# Altium project QuadSerial.PrjPcb
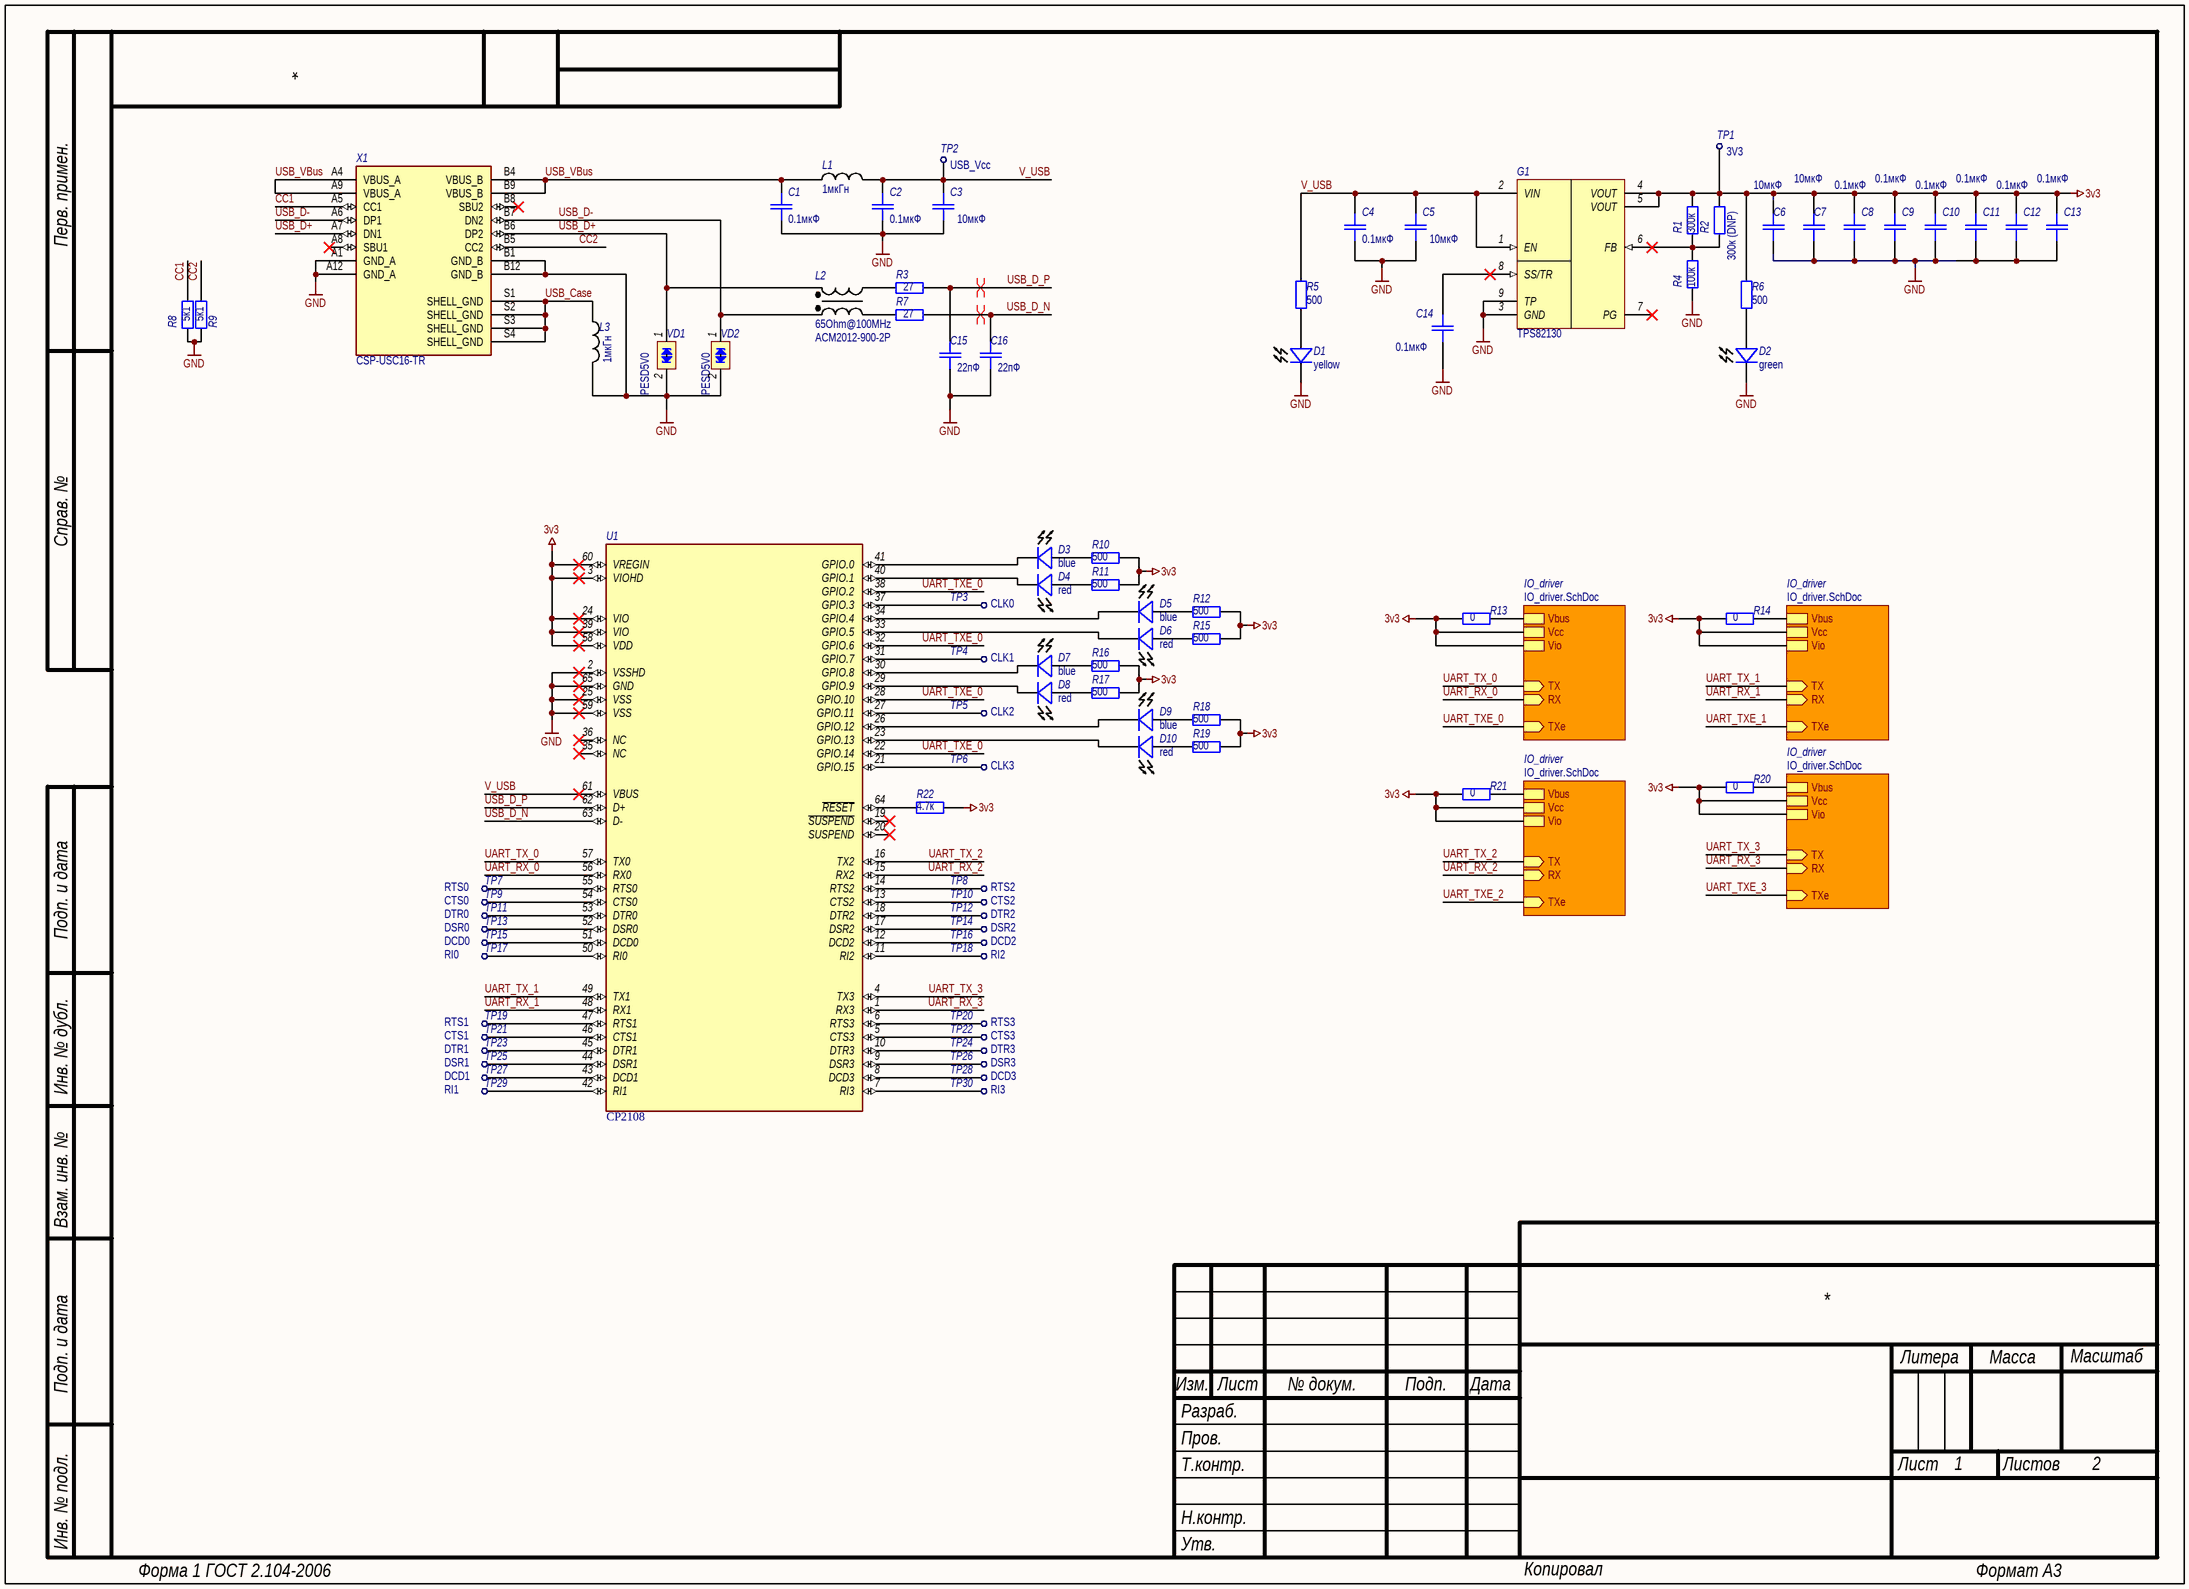
[diagram p0: main.SchDoc]
2 sheets, 182 parts. Net scope: hierarchical (ports join the sheet entries above them; power ports are global).
Board file: QuadSerial.PcbDoc
Sheets:
  main.SchDoc
    IO_driver = IO_driver.SchDoc
    IO_driver = IO_driver.SchDoc
    IO_driver = IO_driver.SchDoc
    IO_driver = IO_driver.SchDoc

## Sheet main.SchDoc
size 410 x 297 mm; SheetNumber: 1; SheetTotal: 2

### Parts
(Parts that share a designator on the sheet are numbered #1, #2 ... from top to bottom, then left to right.)
C1  0.1мкФ  [SMD_C0603]
C2  0.1мкФ  [SMD_C0603]
C3  10мкФ  [SMD_C0805]
C4  0.1мкФ  [SMD_C0603]
C5  10мкФ  [SMD_C0805]
C6  10мкФ  [SMD_C0805]
C7  10мкФ  [SMD_C0805]
C8  0.1мкФ  [SMD_C0603]
C9  0.1мкФ  [SMD_C0603]
C10  0.1мкФ  [SMD_C0603]
C11  0.1мкФ  [SMD_C0603]
C12  0.1мкФ  [SMD_C0603]
C13  0.1мкФ  [SMD_C0603]
C14  0.1мкФ  [SMD_C0603]
C15  22пФ  [SMD_C0603]
C16  22пФ  [SMD_C0603]
D1  value yellow  [LED_0603]  (hidden comment: LED)
D2  value green  [LED_0603]  (hidden comment: LED)
D3  value blue  [LED_0603]  (hidden comment: LED)
D4  value red  [LED_0603]  (hidden comment: LED)
D5  value blue  [LED_0603]  (hidden comment: LED)
D6  value red  [LED_0603]  (hidden comment: LED)
D7  value blue  [LED_0603]  (hidden comment: LED)
D8  value red  [LED_0603]  (hidden comment: LED)
D9  value blue  [LED_0603]  (hidden comment: LED)
D10  value red  [LED_0603]  (hidden comment: LED)
G1  TPS82130  [uSiL-8]
L1  1мкГн  [SMD_0805]
L2  65Ohm@100MHz  Наименование: ACM2012-900-2P  [ACM2012]
L3  1мкГн  [SMD_0805]
R1#1  300к  [SMD_0603]
R2#1  300к (DNP)  [SMD_0603]
R3  27  [SMD_0603]
R4  100к  [SMD_0603]
R5  500  [SMD_0603]
R6  500  [SMD_0603]
R7  27  [SMD_0603]
R8  5к1  [SMD_0603]
R9  5к1  [SMD_0603]
R10  500  [SMD_0603]
R11  500  [SMD_0603]
R12  500  [SMD_0603]
R13  value 0  [SMD_0603]  (hidden comment: OSM R1-8)
R14  value 0  [SMD_0603]  (hidden comment: OSM R1-8)
R15  500  [SMD_0603]
R16  500  [SMD_0603]
R17  500  [SMD_0603]
R18  500  [SMD_0603]
R19  500  [SMD_0603]
R20  value 0  [SMD_0603]  (hidden comment: OSM R1-8)
R21  value 0  [SMD_0603]  (hidden comment: OSM R1-8)
R22  4.7к  [SMD_0603]
TP1  3V3  [TP_PAD_1]
TP2  USB_Vcc  [TP_PAD_1]
TP3  CLK0  [TP_PAD_1]
TP4  CLK1  [TP_PAD_1]
TP5  CLK2  [TP_PAD_1]
TP6  CLK3  [TP_PAD_1]
TP7  RTS0  [TP_PAD_1]
TP8  RTS2  [TP_PAD_1]
TP9  CTS0  [TP_PAD_1]
TP10  CTS2  [TP_PAD_1]
TP11  DTR0  [TP_PAD_1]
TP12  DTR2  [TP_PAD_1]
TP13  DSR0  [TP_PAD_1]
TP14  DSR2  [TP_PAD_1]
TP15  DCD0  [TP_PAD_1]
TP16  DCD2  [TP_PAD_1]
TP17  RI0  [TP_PAD_1]
TP18  RI2  [TP_PAD_1]
TP19  RTS1  [TP_PAD_1]
TP20  RTS3  [TP_PAD_1]
TP21  CTS1  [TP_PAD_1]
TP22  CTS3  [TP_PAD_1]
TP23  DTR1  [TP_PAD_1]
TP24  DTR3  [TP_PAD_1]
TP25  DSR1  [TP_PAD_1]
TP26  DSR3  [TP_PAD_1]
TP27  DCD1  [TP_PAD_1]
TP28  DCD3  [TP_PAD_1]
TP29  RI1  [TP_PAD_1]
TP30  RI3  [TP_PAD_1]
U1  CP2108  [QFN64]
VD1  PESD5V0  [SOD-323]
VD2  PESD5V0  [SOD-323]
X1#1  CSP-USC16-TR  [VALCON_CSP-USC16-TR]

### Sub-sheets
IO_driver = IO_driver.SchDoc: TXe (in), TX (in), RX (in), Vio, Vcc, Vbus
IO_driver = IO_driver.SchDoc: TXe (in), TX (in), RX (in), Vio, Vcc, Vbus
IO_driver = IO_driver.SchDoc: TXe (in), TX (in), RX (in), Vio, Vcc, Vbus
IO_driver = IO_driver.SchDoc: TXe (in), TX (in), RX (in), Vio, Vcc, Vbus

### Nets
3v3: C6.2 C7.2 C8.2 C9.2 C10.2 C11.2 C12.2 C13.2 G1.4(VOUT) G1.5(VOUT) R1#1.1 R2#1.1 R6.1 R10.1 R11.1 R12.1 R13.1 R14.1 R15.1 R16.1 R17.1 R18.1 R19.1 R20.1 R21.1 R22.2 TP1.0(TP) U1.3(VIOHD) U1.24(VIO) U1.39(VIO) U1.58(VDD) U1.60(VREGIN) ; sheet IO_driver/Vio, sheet IO_driver/Vcc, sheet IO_driver/Vio, sheet IO_driver/Vcc, sheet IO_driver/Vio, sheet IO_driver/Vcc, sheet IO_driver/Vio, sheet IO_driver/Vcc  [project net Vcc]
GND: C1.1 C2.1 C3.1 C4.1 C5.1 C6.1 C7.1 C8.1 C9.1 C10.1 C11.1 C12.1 C13.1 C14.1 C15.1 C16.1 D1.2(K) D2.2(K) G1.3(GND) G1.9(TP) L3.2 R4.2 R8.2 R9.2 U1.2(VSSHD) U1.25(VSS) U1.59(VSS) U1.65(GND) VD1.2(cathode_2) VD2.2(cathode_2) X1#1.A1(GND_A) X1#1.A12(GND_A) X1#1.B1(GND_B) X1#1.B12(GND_B)
UART_RX_0: U1.56(RX0) ; sheet IO_driver/RX
UART_RX_1: U1.48(RX1) ; sheet IO_driver/RX
UART_RX_2: U1.15(RX2) ; sheet IO_driver/RX
UART_RX_3: U1.1(RX3) ; sheet IO_driver/RX
UART_TX_0: U1.57(TX0) ; sheet IO_driver/TX
UART_TX_1: U1.49(TX1) ; sheet IO_driver/TX
UART_TX_2: U1.16(TX2) ; sheet IO_driver/TX
UART_TX_3: U1.4(TX3) ; sheet IO_driver/TX
UART_TXE_0: U1.22(GPIO.14) U1.28(GPIO.10) U1.32(GPIO.6) U1.38(GPIO.2) ; sheet IO_driver/TXe
USB_Case: L3.1 X1#1.S1(SHELL_GND) X1#1.S2(SHELL_GND) X1#1.S3(SHELL_GND) X1#1.S4(SHELL_GND)
USB_D+: L2.3 VD1.1(cathode_1) X1#1.A7(DN1) X1#1.B6(DP2)
USB_D-: L2.2 VD2.1(cathode_1) X1#1.A6(DP1) X1#1.B7(DN2)
USB_D_N: C16.2 R7.2 U1.63(D-)
USB_D_P: C15.2 R3.2 U1.62(D+)
USB_VBus: C1.2 L1.1 X1#1.A4(VBUS_A) X1#1.A9(VBUS_A) X1#1.B4(VBUS_B) X1#1.B9(VBUS_B)
V_USB: C2.2 C3.2 C4.2 C5.2 G1.1(EN) G1.2(VIN) L1.2 R5.1 TP2.0(TP) U1.61(VBUS)
СС1: R8.1 X1#1.A5(CC1)
СС2: R9.1 X1#1.B5(CC2)
NetC14_2: C14.2 G1.8(SS/TR)
NetD1_1: D1.1(A) R5.2
NetD2_1: D2.1(A) R6.2
NetD3_1: D3.1(A) R10.2
NetD3_2: D3.2(K) U1.41(GPIO.0)
NetD4_1: D4.1(A) R11.2
NetD4_2: D4.2(K) U1.40(GPIO.1)
NetD5_1: D5.1(A) R12.2
NetD5_2: D5.2(K) U1.34(GPIO.4)
NetD6_1: D6.1(A) R15.2
NetD6_2: D6.2(K) U1.33(GPIO.5)
NetD7_1: D7.1(A) R16.2
NetD7_2: D7.2(K) U1.30(GPIO.8)
NetD8_1: D8.1(A) R17.2
NetD8_2: D8.2(K) U1.29(GPIO.9)
NetD9_1: D9.1(A) R18.2
NetD9_2: D9.2(K) U1.26(GPIO.12)
NetD10_1: D10.1(A) R19.2
NetD10_2: D10.2(K) U1.23(GPIO.13)
NetG1_6: G1.6(FB) R1#1.2 R2#1.2 R4.1
NetL2_1: L2.1 R7.1
NetL2_4: L2.4 R3.1
NetR13_2: R13.2 ; sheet IO_driver/Vbus
NetR14_2: R14.2 ; sheet IO_driver/Vbus
NetR20_2: R20.2 ; sheet IO_driver/Vbus
NetR21_2: R21.2 ; sheet IO_driver/Vbus
NetR22_1: R22.1 U1.64(~{RESET})
NetTP3_0: TP3.0(TP) U1.37(GPIO.3)
NetTP4_0: TP4.0(TP) U1.31(GPIO.7)
NetTP5_0: TP5.0(TP) U1.27(GPIO.11)
NetTP6_0: TP6.0(TP) U1.21(GPIO.15)
NetTP7_0: TP7.0(TP) U1.55(RTS0)
NetTP8_0: TP8.0(TP) U1.14(RTS2)
NetTP9_0: TP9.0(TP) U1.54(CTS0)
NetTP10_0: TP10.0(TP) U1.13(CTS2)
NetTP11_0: TP11.0(TP) U1.53(DTR0)
NetTP12_0: TP12.0(TP) U1.18(DTR2)
NetTP13_0: TP13.0(TP) U1.52(DSR0)
NetTP14_0: TP14.0(TP) U1.17(DSR2)
NetTP15_0: TP15.0(TP) U1.51(DCD0)
NetTP16_0: TP16.0(TP) U1.12(DCD2)
NetTP17_0: TP17.0(TP) U1.50(RI0)
NetTP18_0: TP18.0(TP) U1.11(RI2)
NetTP19_0: TP19.0(TP) U1.47(RTS1)
NetTP20_0: TP20.0(TP) U1.6(RTS3)
NetTP21_0: TP21.0(TP) U1.46(CTS1)
NetTP22_0: TP22.0(TP) U1.5(CTS3)
NetTP23_0: TP23.0(TP) U1.45(DTR1)
NetTP24_0: TP24.0(TP) U1.10(DTR3)
NetTP25_0: TP25.0(TP) U1.44(DSR1)
NetTP26_0: TP26.0(TP) U1.9(DSR3)
NetTP27_0: TP27.0(TP) U1.43(DCD1)
NetTP28_0: TP28.0(TP) U1.8(DCD3)
NetTP29_0: TP29.0(TP) U1.42(RI1)
NetTP30_0: TP30.0(TP) U1.7(RI3)

Not connected (* = marked no-connect by the designer): G1 7(PG)*; U1 19(~{SUSPEND})* 20(SUSPEND)* 35(NC)* 36(NC)*; X1#1 A8(SBU1)* B8(SBU2)*

### Layout directives
differential pair: USB_D_N, USB_D_P

### Notes on the sheet
- Перв. примен.
- Справ. №
- Подп. и дата
- Инв. № дубл.
- Взам. инв. №
- Изм.
- Разраб.
- Лист
- № докум.
- Подп.
- Дата
- Литера
- Масса
- Масштаб
- Пров.
- Т.контр.
- Листов
- Н.контр.
- Утв.
- Инв. № подл.
- Форма 1 ГОСТ 2.104-2006
- Копировал
- Формат А3

### Library data of the parts
C1-C16 = Capacitor: Назначение: SMD-конденсатор; Наименование: Конденсатор; Потребление, Вт: 0; Place_v1: *; Plcae_v2: *
  C1 C2 C4 C8-C14: Value: 0.1мкФ
  C3 C5-C7: Value: 10мкФ
  C15 C16: Value: 22пФ
D1-D10 = LED: Назначение: Светодиод; Наименование: SMD-LED; Потребление, Вт: 0,01
G1 = TPS82130: 17-V Input 3-A Step-Down Converter MicroSiP™ Module with Integrated Inductor; Потребление, Вт: 1,0; ComponentLink1Description: Data sheet; ComponentLink1URL: http://www.ti.com/lit/ds/symlink/tps82130.pdf; Назначение: 17-V Input 3-A Step-Down Converter MicroSiP™ Module with Integrated Inductor; DataSheet: https://www.ti.com/lit/ds/symlink/tps82130.pdf?ts=1592813288219&ref_url=https%253A%252F%252Fwww.google.com%252F; Supplier 1: Digi-Key; Supplier Part Number 1: 296-43922-1-ND; Наименование: TPS82130
L1 L3 = Inductor: Наименование: Индуктивность; Назначение: SMD-индуктивность; Потребление, Вт: 0,010; Value: 1мкГн; Place_v1: *; Plcae_v2: *
L2 = Inductor_coupled: Coupled inductor; Назначение: Связанная индуктивность; Потребление, Вт: 0,1; Value: 65Ohm@100MHz; Place_v1: *; Plcae_v2: *
R1#1 R2#1 R3-R12 R15-R19 R22 = Resistor: Наименование: Резистор; Назначение: SMD-резистор; Потребление, Вт: 0,001; Place_v1: *; Plcae_v2: *
  R1: Value: 300к
  R2: Value: 300к (DNP)
  R3 R7: Value: 27
  R4: Value: 100к
  R5 R6 R10-R12 R15-R19: Value: 500
  R8 R9: Value: 5к1
  R22: Value: 4.7к
R13 R14 R20 R21 = Resistor: Наименование: ОСМ Р1-12; Назначение: SMD-резистор; Потребление, Вт: 0,001; Точность: %
TP1-TP30 = TP: Наименование: Точка проверки; Назначение: Контроль параметров платы
  TP1: TP_Name: 3V3
  TP2: TP_Name: USB_Vcc
  TP3: TP_Name: CLK0
  TP4: TP_Name: CLK1
  TP5: TP_Name: CLK2
  TP6: TP_Name: CLK3
  TP7: TP_Name: RTS0
  TP8: TP_Name: RTS2
  TP9: TP_Name: CTS0
  TP10: TP_Name: CTS2
  TP11: TP_Name: DTR0
  TP12: TP_Name: DTR2
  TP13: TP_Name: DSR0
  TP14: TP_Name: DSR2
  TP15: TP_Name: DCD0
  TP16: TP_Name: DCD2
  TP17: TP_Name: RI0
  TP18: TP_Name: RI2
  TP19: TP_Name: RTS1
  TP20: TP_Name: RTS3
  TP21: TP_Name: CTS1
  TP22: TP_Name: CTS3
  TP23: TP_Name: DTR1
  TP24: TP_Name: DTR3
  TP25: TP_Name: DSR1
  TP26: TP_Name: DSR3
  TP27: TP_Name: DCD1
  TP28: TP_Name: DCD3
  TP29: TP_Name: RI1
  TP30: TP_Name: RI3
U1 = CP2108-B03-GMR: The CP2108 is a highly integrated USB to Quad UART Bridge / Controller providing a simple solution for updating RS-232/ / RS-485 designs to USB using a minimum of components and / PCB space
VD1 VD2 = PESDxL1BA: Low capacitance bidirectional ESD protection diodes; Назначение: ESD защитные диоды; Потребление, Вт: 0.0; Наименование: PESD5V0S1BA; ComponentLink1Description: DataSheet; ComponentLink1URL: https://static.chipdip.ru/lib/635/DOC005635911.pdf; Place_v1: *; Plcae_v2: *
X1#1 = CSP-USC16-TR: CSP-USC16-TR Valcon USB Type C Surface Mount PCB Socket; Назначение: SMD соединитель USB type C; Потребление, Вт: 0; Package: None; Purchase-URL: https://pricing.snapeda.com/search/part/CSP-USC16-TR/?ref=eda; MP: CSP-USC16-TR; Check_prices: https://www.snapeda.com/parts/CSP-USC16-TR/Valcon/view-part/4783629/?ref=eda; MF: Valcon; Value: *; Availability: No availability data; Price: None; SnapEDA_Link: https://www.snapeda.com/parts/CSP-USC16-TR/Valcon/view-part/4783629/?ref=snap; Наименование: CSP-USC16-TR; Place_v1: *; Plcae_v2: *

## Sheet IO_driver.SchDoc
size 410 x 297 mm; SheetNumber: 2; SheetTotal: 2
Used 4 times, as channels IO_driver, IO_driver, IO_driver, IO_driver. Parts and nets are listed once, with the designators drawn on the sheet.
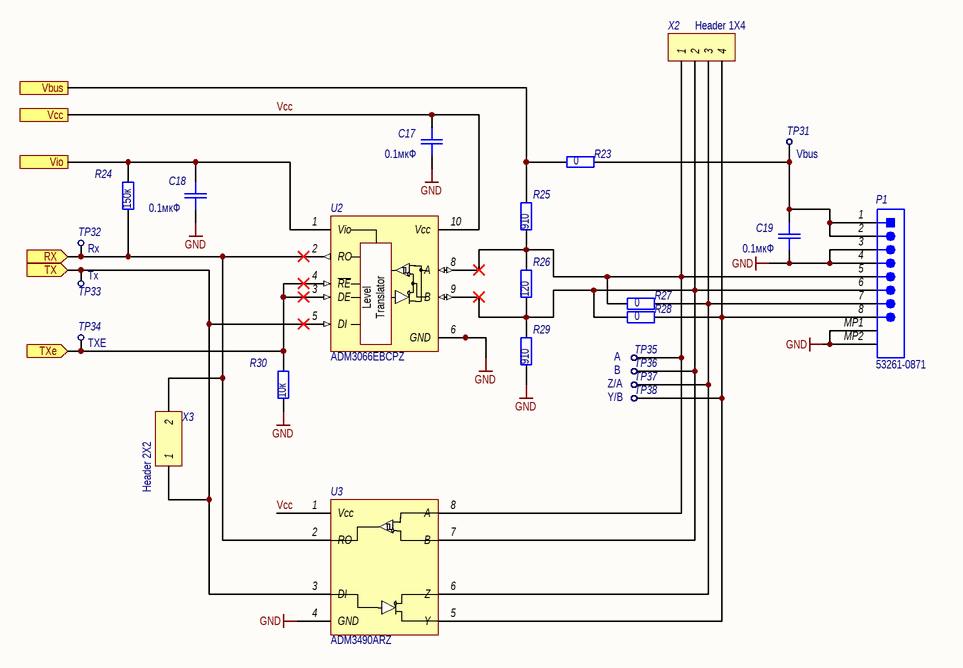
[diagram p1: IO_driver.SchDoc]

### Parts
C17  0.1мкФ  [SMD_C0603]
C18  0.1мкФ  [SMD_C0603]
C19  0.1мкФ  [SMD_C0603]
P1  PicoBlade_53261-0871  [53261-0871]  (value not drawn)
R23  value 0  [SMD_0603]  (hidden comment: OSM R1-8)
R24  150к  [SMD_0603]
R25  910  [SMD_0603]
R26  120  [SMD_0603]
R27  value 0  [SMD_0603]  (hidden comment: OSM R1-8)
R28  value 0  [SMD_0603]  (hidden comment: OSM R1-8)
R29  910  [SMD_0603]
R30  10к  [SMD_0603]
TP31  Vbus  [TP_PAD_1]
TP32  Rx  [TP_PAD_1]
TP33  Tx  [TP_PAD_1]
TP34  TXE  [TP_PAD_1]
TP35  A  [TP_PAD_1]
TP36  B  [TP_PAD_1]
TP37  Z/A  [TP_PAD_1]
TP38  Y/B  [TP_PAD_1]
U2  ADM3066EBCPZ  [LFCSP-10_3x3]
U3  ADM3490ARZ  [SOIC-8]
X2  Header 1X4  [PLS-4]
X3  Header 2X2  [PLD2-2]

### Ports
RX (in, see main[3A]), TX (in, see main[3A]), TXe (in, see main[3A]), Vbus (see main[3A]), Vcc (see main[3A]), Vio (see main[3A])

### Nets
GND: C17.1 C18.1 C19.1 P1.3 P1.4 P1.MP1 P1.MP2 R29.2 R30.2 U2.6(GND) U2.11(GND) U3.4(GND)
RX: R24.2 TP32.0(TP) U2.2(RO) U3.2(RO) X3.2 ; port RX
TX: TP33.0(TP) U2.5(DI) U3.3(DI) X3.1 ; port TX
TXe: R30.1 TP34.0(TP) U2.3(DE) U2.4(~{RE}) ; port TXe
Vbus: R23.1 R25.1 ; port Vbus
Vcc: C17.2 U2.10(Vcc) U3.1(Vcc) ; port Vcc
Vio: C18.2 R24.1 U2.1(Vio) ; port Vio
NetC19_2: C19.2 P1.1 P1.2 R23.2 TP31.0(TP)
NetP1_5: P1.5 R25.2 R26.1 R27.1 TP35.0(TP) U2.8(A) U3.8(A) X2.1
NetP1_6: P1.6 R26.2 R28.1 R29.1 TP36.0(TP) U2.9(B) U3.7(B) X2.2
NetP1_7: P1.7 R27.2 TP37.0(TP) U3.6(Z) X2.3
NetP1_8: P1.8 R28.2 TP38.0(TP) U3.5(Y) X2.4

### Channels
IO_driver: designators C17=C17_IO_driver#1 C18=C18_IO_driver#1 C19=C19_IO_driver#1 P1=P1 R23=R23_IO_driver#1 R24=R24_IO_driver#1 R25=R25_IO_driver#1 R26=R26_IO_driver#1 R27=R1#2 R28=R2#2 R29=R29_IO_driver#1 R30=R30_IO_driver#1 TP31=TP31_IO_driver#1 TP32=TP32_IO_driver#1 TP33=TP33_IO_driver#1 TP34=TP34_IO_driver#1 TP35=TP35_IO_driver#1 TP36=TP36_IO_driver#1 TP37=TP37_IO_driver#1 TP38=TP38_IO_driver#1 U2=U2_IO_driver#1 U3=U3_IO_driver#1 X2=X1#2 X3=X3_IO_driver#1; ports RX=UART_RX_0 TX=UART_TX_0 TXe=UART_TXE_0 Vbus=NetR13_2 Vcc=Vcc Vio=Vcc
IO_driver: designators C17=C17_IO_driver#2 C18=C18_IO_driver#2 C19=C19_IO_driver#2 P1=P1_IO_driver#1 R23=R23_IO_driver#2 R24=R24_IO_driver#2 R25=R25_IO_driver#2 R26=R26_IO_driver#2 R27=R27_IO_driver#1 R28=R28_IO_driver#1 R29=R29_IO_driver#2 R30=R30_IO_driver#2 TP31=TP31_IO_driver#2 TP32=TP32_IO_driver#2 TP33=TP33_IO_driver#2 TP34=TP34_IO_driver#2 TP35=TP35_IO_driver#2 TP36=TP36_IO_driver#2 TP37=TP37_IO_driver#2 TP38=TP38_IO_driver#2 U2=U2_IO_driver#2 U3=U3_IO_driver#2 X2=X2_IO_driver#1 X3=X3_IO_driver#2; ports RX=UART_RX_1 TX=UART_TX_1 TXe=UART_TXE_1 Vbus=NetR14_2 Vcc=Vcc Vio=Vcc
IO_driver: designators C17=C17_IO_driver#3 C18=C18_IO_driver#3 C19=C19_IO_driver#3 P1=P1_IO_driver#2 R23=R23_IO_driver#3 R24=R24_IO_driver#3 R25=R25_IO_driver#3 R26=R26_IO_driver#3 R27=R27_IO_driver#2 R28=R28_IO_driver#2 R29=R29_IO_driver#3 R30=R30_IO_driver#3 TP31=TP31_IO_driver#3 TP32=TP32_IO_driver#3 TP33=TP33_IO_driver#3 TP34=TP34_IO_driver#3 TP35=TP35_IO_driver#3 TP36=TP36_IO_driver#3 TP37=TP37_IO_driver#3 TP38=TP38_IO_driver#3 U2=U2_IO_driver#3 U3=U3_IO_driver#3 X2=X2_IO_driver#2 X3=X3_IO_driver#3; ports RX=UART_RX_2 TX=UART_TX_2 TXe=UART_TXE_2 Vbus=NetR21_2 Vcc=Vcc Vio=Vcc
IO_driver: designators C17=C17_IO_driver#4 C18=C18_IO_driver#4 C19=C19_IO_driver#4 P1=P1_IO_driver#3 R23=R23_IO_driver#4 R24=R24_IO_driver#4 R25=R25_IO_driver#4 R26=R26_IO_driver#4 R27=R27_IO_driver#3 R28=R28_IO_driver#3 R29=R29_IO_driver#4 R30=R30_IO_driver#4 TP31=TP31_IO_driver#4 TP32=TP32_IO_driver#4 TP33=TP33_IO_driver#4 TP34=TP34_IO_driver#4 TP35=TP35_IO_driver#4 TP36=TP36_IO_driver#4 TP37=TP37_IO_driver#4 TP38=TP38_IO_driver#4 U2=U2_IO_driver#4 U3=U3_IO_driver#4 X2=X2_IO_driver#3 X3=X3_IO_driver#4; ports RX=UART_RX_3 TX=UART_TX_3 TXe=UART_TXE_3 Vbus=NetR20_2 Vcc=Vcc Vio=Vcc

### Notes on the sheet
- Подп. и дата
- Инв. № дубл.
- Взам. инв. №
- Инв. № подл.
- Изм.
- Лист
- № докум.
- Подп.
- Дата
- Форма 2а ГОСТ 2.104-2006
- Копировал
- Формат А3
- (in symbol ADM3066E) Level; Translator

### Library data of the parts
C17-C19 = Capacitor: as C1 on sheet main; Value: 0.1мкФ; Place_v1: *; Plcae_v2: *
P1 = PicoBlade_53261-0871: Male Header, Pitch 1.25 mm, 1 x 8 Position, Height 3.4 mm, -40 to 85 degC, RoHS, Tape and Reel; Потребление, Вт: 0.0; Назначение: Male Header, Pitch 1.25 mm, 1 x 8 Position, Height 3.4 mm, -40 to 85 degC, RoHS, Tape and Reel; ComponentLink1Description: DataSheet; ComponentLink1URL: http://www.molex.com/pdm_docs/sd/532610671_sd.pdf; Наименование: 53261-0871
R23 R27 R28 = Resistor: as R13 on sheet main
R24-R26 R29 R30 = Resistor: as R1#1 on sheet main; Place_v1: *; Plcae_v2: *
  R24: Value: 150к
  R25 R29: Value: 910
  R26: Value: 120
  R30: Value: 10к
TP31-TP38 = TP: as TP1 on sheet main
  TP31: TP_Name: Vbus
  TP32: TP_Name: Rx
  TP33: TP_Name: Tx
  TP34: TP_Name: TXE
  TP35: TP_Name: A
  TP36: TP_Name: B
  TP37: TP_Name: Z/A
  TP38: TP_Name: Y/B
U2 = ADM3066E: 3.0 V to 5.5 V, ±12 kV IEC ESD Protected, 500 kbps/50 Mbps RS-485 Transceiver; Потребление, Вт: 0,1; Наименование: ADM3066EBCPZ; Назначение: RS-485 Transceiver
U3 = ADM3490: 3.3 V Slew Rate Limited, Half- and / Full-Duplex, RS-485/RS-422 Transceivers; Наименование: ADM3066EBCPZ; Назначение: RS-485 Transceiver; Потребление, Вт: 0,1
X2 = Header 1X4: Header, 4-Pin, Single row; Потребление, Вт: 0,0; Назначение: Header, 4-Pin, Single row; Наименование: Header 1X4
X3 = Header 2X2: Header, 2-Pin, Dual row; Потребление, Вт: 0,0; Назначение: Header, 2-Pin, Dual row; Наименование: Header 2X2

## Nets that join several sheets
GND: main (34 pins), IO_driver (12 pins), IO_driver (12 pins), IO_driver (12 pins), IO_driver (12 pins)
Vcc: main (32 pins), IO_driver (6 pins), IO_driver (6 pins), IO_driver (6 pins), IO_driver (6 pins)
NetR13_2: main (R13.2), IO_driver (R23_IO_driver#1.1 R25_IO_driver#1.1)
NetR14_2: main (R14.2), IO_driver (R23_IO_driver#2.1 R25_IO_driver#2.1)
NetR20_2: main (R20.2), IO_driver (R23_IO_driver#4.1 R25_IO_driver#4.1)
NetR21_2: main (R21.2), IO_driver (R23_IO_driver#3.1 R25_IO_driver#3.1)
UART_RX_0: main (U1.56), IO_driver (5 pins)
UART_RX_1: main (U1.48), IO_driver (5 pins)
UART_RX_2: main (U1.15), IO_driver (5 pins)
UART_RX_3: main (U1.1), IO_driver (5 pins)
UART_TX_0: main (U1.57), IO_driver (TP33_IO_driver#1.0 U2_IO_driver#1.5 U3_IO_driver#1.3 X3_IO_driver#1.1)
UART_TX_1: main (U1.49), IO_driver (TP33_IO_driver#2.0 U2_IO_driver#2.5 U3_IO_driver#2.3 X3_IO_driver#2.1)
UART_TX_2: main (U1.16), IO_driver (TP33_IO_driver#3.0 U2_IO_driver#3.5 U3_IO_driver#3.3 X3_IO_driver#3.1)
UART_TX_3: main (U1.4), IO_driver (TP33_IO_driver#4.0 U2_IO_driver#4.5 U3_IO_driver#4.3 X3_IO_driver#4.1)
UART_TXE_0: main (U1.22 U1.28 U1.32 U1.38), IO_driver (R30_IO_driver#1.1 TP34_IO_driver#1.0 U2_IO_driver#1.3 U2_IO_driver#1.4)